# Altium schematic sheet top.SchDoc
size A3; DocumentNumber: 1; SheetNumber: 1; SheetTotal: 6
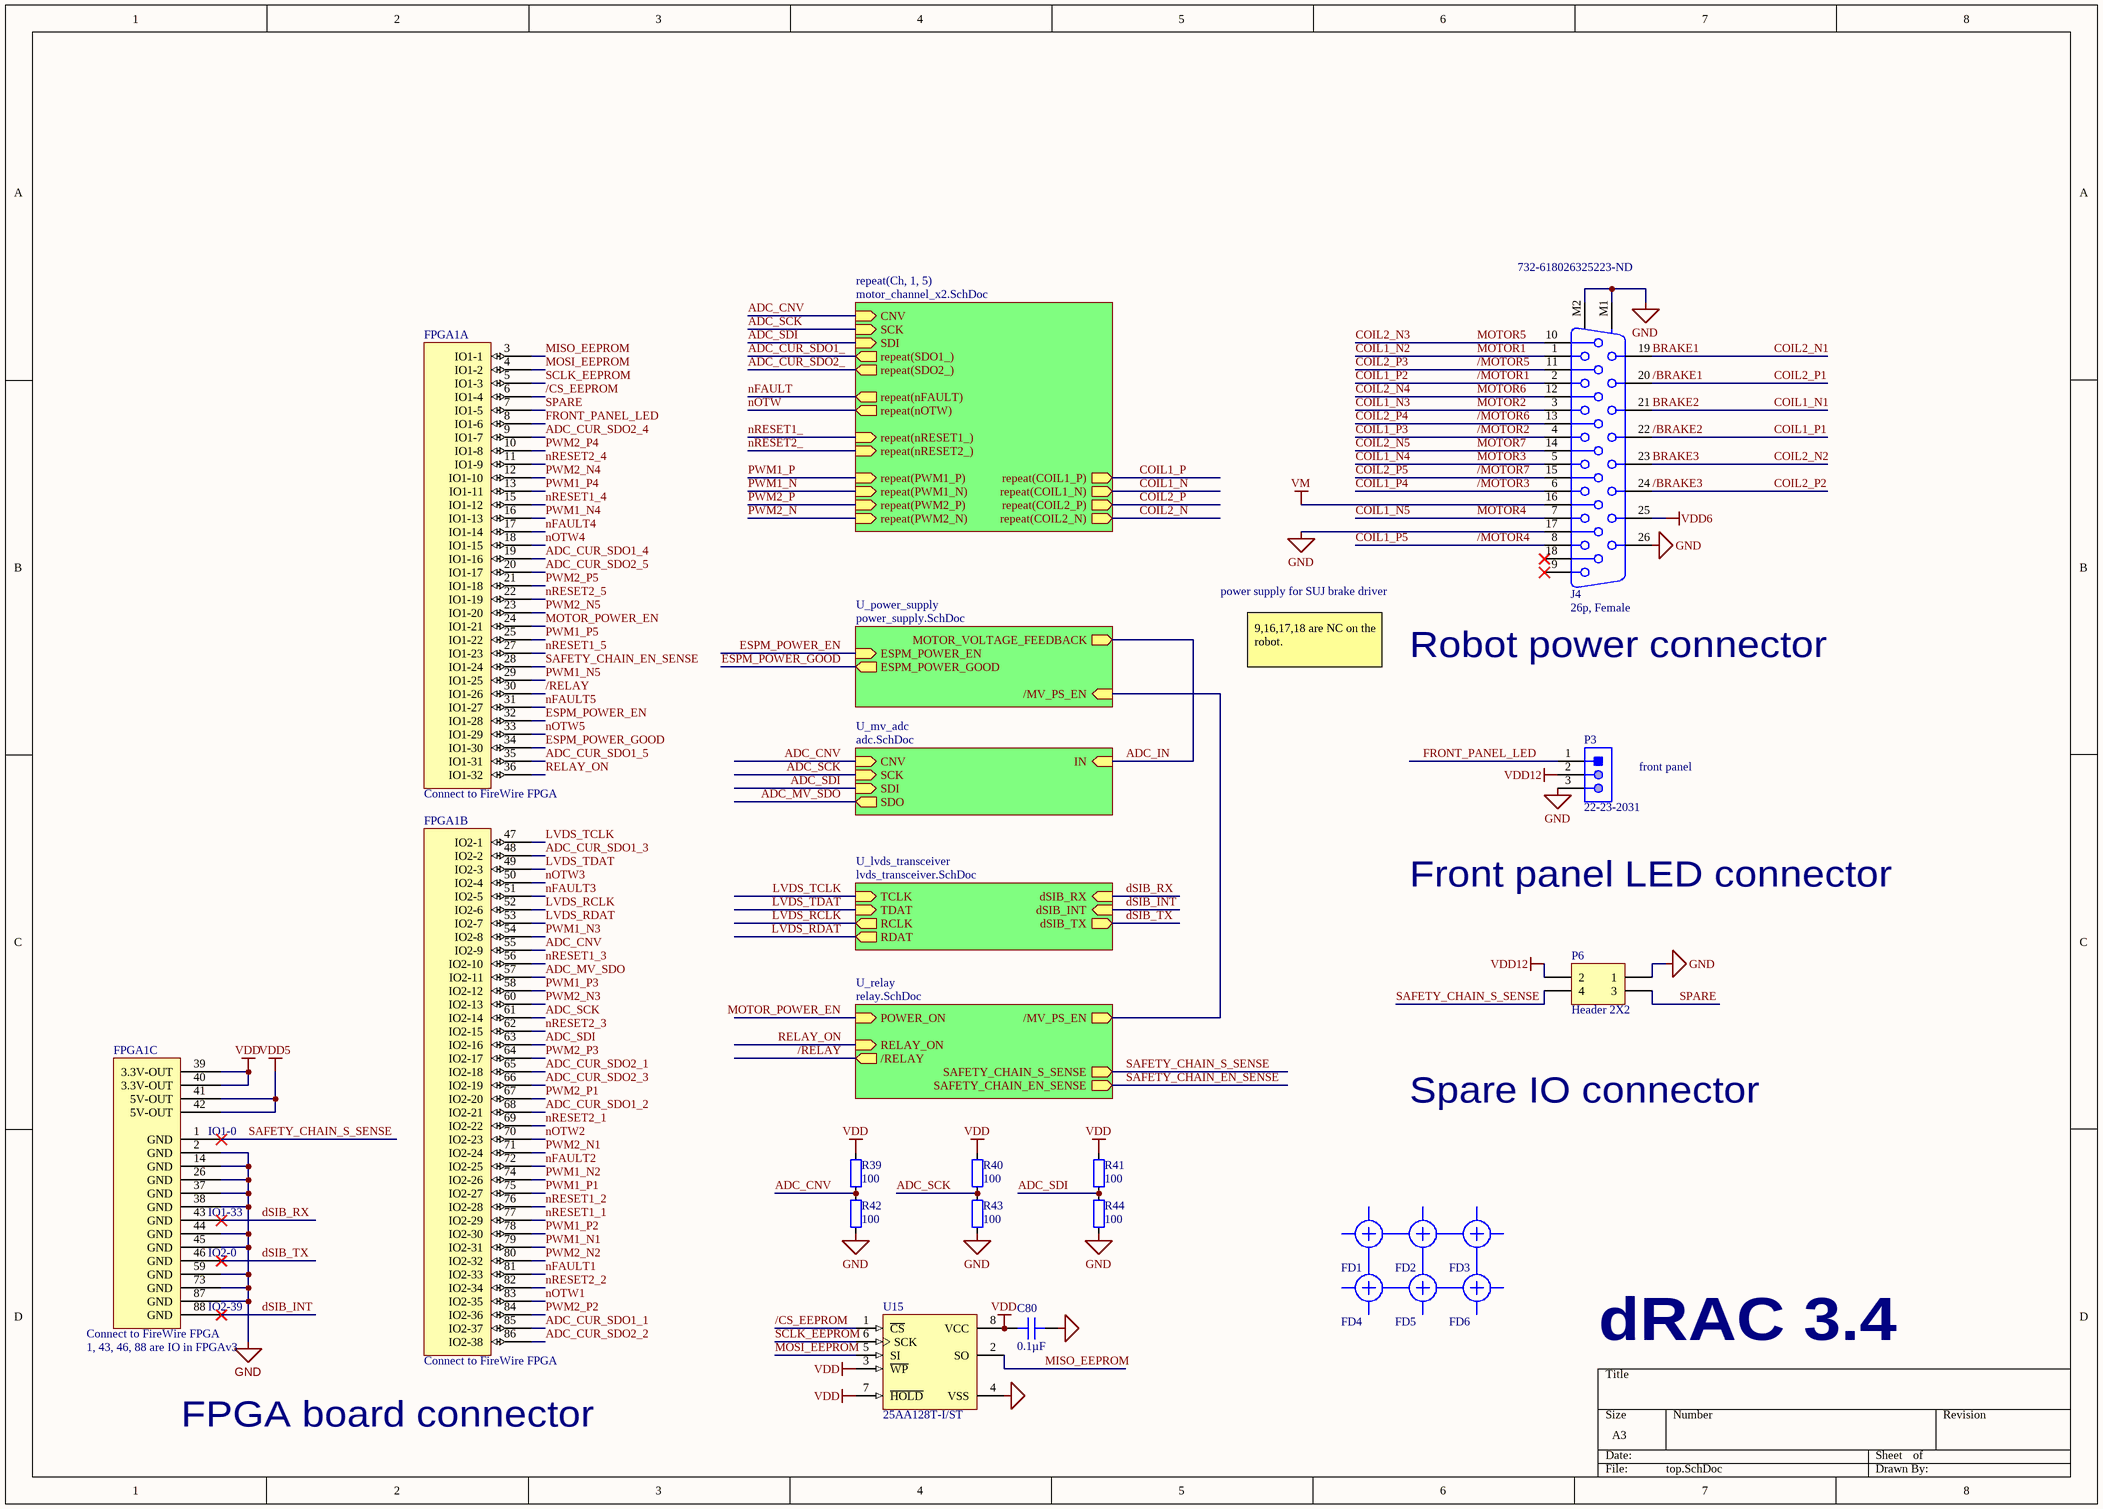
[diagram p0: top.SchDoc]

## Parts
C80  0.1µF  [FP-GRM155-0_05-IPC_B]
FD1  FD  [FD]  (value not drawn)  (no BOM)
FD2  FD  [FD]  (value not drawn)  (no BOM)
FD3  FD  [FD]  (value not drawn)  (no BOM)
FD4  FD  [FD]  (value not drawn)  (no BOM)
FD5  FD  [FD]  (value not drawn)  (no BOM)
FD6  FD  [FD]  (value not drawn)  (no BOM)
FPGA1  Connect to FireWire FPGA  [FPGA-dummy]  (parts A,B,C of 3)
J4  26p, Female  Supplier Part Number 1: 732-618026325223-ND  [618026325223]
P3  22-23-2031  [MOLX-22-23-2031_V]
P6  Header 2X2  [DF11-4DP-2DSA]
R39  value 100  [FP-CRCW0805-HPe3-IPC_B]  (hidden comment: Res_0805)
R40  value 100  [FP-CRCW0805-HPe3-IPC_B]  (hidden comment: Res_0805)
R41  value 100  [FP-CRCW0805-HPe3-IPC_B]  (hidden comment: Res_0805)
R42  value 100  [FP-CRCW0805-HPe3-IPC_B]  (hidden comment: Res_0805)
R43  value 100  [FP-CRCW0805-HPe3-IPC_B]  (hidden comment: Res_0805)
R44  value 100  [FP-CRCW0805-HPe3-IPC_B]  (hidden comment: Res_0805)
U15  25AA128T-I/ST  [TSSOP-ST8_N]

## Sub-sheets
repeat(Ch, 1, 5) = motor_channel_x2.SchDoc: repeat(COIL1_P) (out), repeat(COIL1_N) (out), repeat(COIL2_P) (out), repeat(COIL2_N) (out), repeat(SDO1_) (out), repeat(SDO2_) (out), CNV (in), SCK (in), SDI (in), repeat(nRESET1_) (in), repeat(nRESET2_) (in), repeat(PWM1_P) (in), repeat(PWM1_N) (in), repeat(PWM2_P) (in), repeat(PWM2_N) (in), repeat(nFAULT) (out), repeat(nOTW) (out)
U_lvds_transceiver = lvds_transceiver.SchDoc: RCLK (out), RDAT (out), TCLK (in), TDAT (in), dSIB_RX (in), dSIB_INT (in), dSIB_TX (out)
U_mv_adc = adc.SchDoc: CNV (in), SCK (in), SDI (in), SDO (out), IN (in)
U_power_supply = power_supply.SchDoc: MOTOR_VOLTAGE_FEEDBACK (out), ESPM_POWER_GOOD (out), ESPM_POWER_EN (in), /MV_PS_EN (in)
U_relay = relay.SchDoc: POWER_ON (in), RELAY_ON (in), /RELAY (out), /MV_PS_EN (out), SAFETY_CHAIN_S_SENSE (out), SAFETY_CHAIN_EN_SENSE (out)

## Nets
GND: C80.2 FPGA1.2(GND) FPGA1.14(GND) FPGA1.26(GND) FPGA1.37(GND) FPGA1.38(GND) FPGA1.44(GND) FPGA1.45(GND) FPGA1.59(GND) FPGA1.73(GND) FPGA1.87(GND) J4.17 J4.26 J4.M1 J4.M2 P3.3 P6.1 R42.1 R43.1 R44.1 U15.4(VSS)
VDD: C80.1 FPGA1.39(3.3V-OUT) FPGA1.40(3.3V-OUT) R39.2 R40.2 R41.2 U15.3(~{WP}) U15.7(~{HOLD}) U15.8(VCC)
VDD5: FPGA1.41(5V-OUT) FPGA1.42(5V-OUT)
VDD6: J4.25
VDD12: P3.2 P6.2
VM: J4.16
/BRAKE1: J4.20  [also labelled COIL2_P1]
/BRAKE2: J4.22  [also labelled COIL1_P1]
/BRAKE3: J4.24  [also labelled COIL2_P2]
/CS_EEPROM: FPGA1.6(IO1-4) U15.1(~{CS})
/MOTOR1: J4.2  [also labelled COIL1_P2]
/MOTOR2: J4.4  [also labelled COIL1_P3]
/MOTOR3: J4.6  [also labelled COIL1_P4]
/MOTOR4: J4.8  [also labelled COIL1_P5]
/MOTOR5: J4.11  [also labelled COIL2_P3]
/MOTOR6: J4.13  [also labelled COIL2_P4]
/MOTOR7: J4.15  [also labelled COIL2_P5]
/RELAY: FPGA1.30(IO1-26) ; sheet U_relay//RELAY
ADC_CNV: FPGA1.55(IO2-9) R39.1 R42.2 ; sheet U_mv_adc/CNV, sheet repeat(Ch, 1, 5)/CNV
ADC_CUR_SDO1_: sheet repeat(Ch, 1, 5)/repeat(SDO1_)
ADC_CUR_SDO1_1: FPGA1.85(IO2-37)
ADC_CUR_SDO1_2: FPGA1.68(IO2-21)
ADC_CUR_SDO1_3: FPGA1.48(IO2-2)
ADC_CUR_SDO1_4: FPGA1.19(IO1-16)
ADC_CUR_SDO1_5: FPGA1.35(IO1-31)
ADC_CUR_SDO2_: sheet repeat(Ch, 1, 5)/repeat(SDO2_)
ADC_CUR_SDO2_1: FPGA1.65(IO2-18)
ADC_CUR_SDO2_2: FPGA1.86(IO2-38)
ADC_CUR_SDO2_3: FPGA1.66(IO2-19)
ADC_CUR_SDO2_4: FPGA1.9(IO1-7)
ADC_CUR_SDO2_5: FPGA1.20(IO1-17)
ADC_IN: sheet U_mv_adc/IN, sheet U_power_supply/MOTOR_VOLTAGE_FEEDBACK
ADC_MV_SDO: FPGA1.57(IO2-11) ; sheet U_mv_adc/SDO
ADC_SCK: FPGA1.61(IO2-14) R40.1 R43.2 ; sheet U_mv_adc/SCK, sheet repeat(Ch, 1, 5)/SCK
ADC_SDI: FPGA1.63(IO2-16) R41.1 R44.2 ; sheet U_mv_adc/SDI, sheet repeat(Ch, 1, 5)/SDI
BRAKE1: J4.19  [also labelled COIL2_N1]
BRAKE2: J4.21  [also labelled COIL1_N1]
BRAKE3: J4.23  [also labelled COIL2_N2]
COIL1_N: sheet repeat(Ch, 1, 5)/repeat(COIL1_N)
COIL1_N2: J4.1  [also labelled MOTOR1]
COIL1_N3: J4.3  [also labelled MOTOR2]
COIL1_N4: J4.5  [also labelled MOTOR3]
COIL1_N5: J4.7  [also labelled MOTOR4]
COIL1_P: sheet repeat(Ch, 1, 5)/repeat(COIL1_P)
COIL2_N: sheet repeat(Ch, 1, 5)/repeat(COIL2_N)
COIL2_N3: J4.10  [also labelled MOTOR5]
COIL2_N4: J4.12  [also labelled MOTOR6]
COIL2_N5: J4.14  [also labelled MOTOR7]
COIL2_P: sheet repeat(Ch, 1, 5)/repeat(COIL2_P)
dSIB_INT: FPGA1.88(GND) ; sheet U_lvds_transceiver/dSIB_INT
dSIB_RX: FPGA1.43(GND) ; sheet U_lvds_transceiver/dSIB_RX
dSIB_TX: FPGA1.46(GND) ; sheet U_lvds_transceiver/dSIB_TX
ESPM_POWER_EN: FPGA1.32(IO1-28) ; sheet U_power_supply/ESPM_POWER_EN
ESPM_POWER_GOOD: FPGA1.34(IO1-30) ; sheet U_power_supply/ESPM_POWER_GOOD
FRONT_PANEL_LED: FPGA1.8(IO1-6) P3.1
LVDS_RCLK: FPGA1.52(IO2-6) ; sheet U_lvds_transceiver/RCLK
LVDS_RDAT: FPGA1.53(IO2-7) ; sheet U_lvds_transceiver/RDAT
LVDS_TCLK: FPGA1.47(IO2-1) ; sheet U_lvds_transceiver/TCLK
LVDS_TDAT: FPGA1.49(IO2-3) ; sheet U_lvds_transceiver/TDAT
MISO_EEPROM: FPGA1.3(IO1-1) U15.2(SO)
MOSI_EEPROM: FPGA1.4(IO1-2) U15.5(SI)
MOTOR_POWER_EN: FPGA1.24(IO1-21) ; sheet U_relay/POWER_ON
nFAULT: sheet repeat(Ch, 1, 5)/repeat(nFAULT)
nFAULT1: FPGA1.81(IO2-33)
nFAULT2: FPGA1.72(IO2-25)
nFAULT3: FPGA1.51(IO2-5)
nFAULT4: FPGA1.17(IO1-14)
nFAULT5: FPGA1.31(IO1-27)
nOTW: sheet repeat(Ch, 1, 5)/repeat(nOTW)
nOTW1: FPGA1.83(IO2-35)
nOTW2: FPGA1.70(IO2-23)
nOTW3: FPGA1.50(IO2-4)
nOTW4: FPGA1.18(IO1-15)
nOTW5: FPGA1.33(IO1-29)
nRESET1_: sheet repeat(Ch, 1, 5)/repeat(nRESET1_)
nRESET1_1: FPGA1.77(IO2-29)
nRESET1_2: FPGA1.76(IO2-28)
nRESET1_3: FPGA1.56(IO2-10)
nRESET1_4: FPGA1.15(IO1-12)
nRESET1_5: FPGA1.27(IO1-23)
nRESET2_: sheet repeat(Ch, 1, 5)/repeat(nRESET2_)
nRESET2_1: FPGA1.69(IO2-22)
nRESET2_2: FPGA1.82(IO2-34)
nRESET2_3: FPGA1.62(IO2-15)
nRESET2_4: FPGA1.11(IO1-9)
nRESET2_5: FPGA1.22(IO1-19)
PWM1_N: sheet repeat(Ch, 1, 5)/repeat(PWM1_N)
PWM1_N1: FPGA1.79(IO2-31)
PWM1_N2: FPGA1.74(IO2-26)
PWM1_N3: FPGA1.54(IO2-8)
PWM1_N4: FPGA1.16(IO1-13)
PWM1_N5: FPGA1.29(IO1-25)
PWM1_P: sheet repeat(Ch, 1, 5)/repeat(PWM1_P)
PWM1_P1: FPGA1.75(IO2-27)
PWM1_P2: FPGA1.78(IO2-30)
PWM1_P3: FPGA1.58(IO2-12)
PWM1_P4: FPGA1.13(IO1-11)
PWM1_P5: FPGA1.25(IO1-22)
PWM2_N: sheet repeat(Ch, 1, 5)/repeat(PWM2_N)
PWM2_N1: FPGA1.71(IO2-24)
PWM2_N2: FPGA1.80(IO2-32)
PWM2_N3: FPGA1.60(IO2-13)
PWM2_N4: FPGA1.12(IO1-10)
PWM2_N5: FPGA1.23(IO1-20)
PWM2_P: sheet repeat(Ch, 1, 5)/repeat(PWM2_P)
PWM2_P1: FPGA1.67(IO2-20)
PWM2_P2: FPGA1.84(IO2-36)
PWM2_P3: FPGA1.64(IO2-17)
PWM2_P4: FPGA1.10(IO1-8)
PWM2_P5: FPGA1.21(IO1-18)
RELAY_ON: FPGA1.36(IO1-32) ; sheet U_relay/RELAY_ON
SAFETY_CHAIN_EN_SENSE: FPGA1.28(IO1-24) ; sheet U_relay/SAFETY_CHAIN_EN_SENSE
SAFETY_CHAIN_S_SENSE: FPGA1.1(GND) P6.4 ; sheet U_relay/SAFETY_CHAIN_S_SENSE
SCLK_EEPROM: FPGA1.5(IO1-3) U15.6(SCK)
SPARE: FPGA1.7(IO1-5) P6.3
(unnamed): sheet U_power_supply//MV_PS_EN, sheet U_relay//MV_PS_EN

Not connected (* = marked no-connect by the designer): J4 9* 18*

## Notes on the sheet
- power supply for SUJ brake driver
- 9,16,17,18 are NC on the robot.
- Robot power connector
- front panel
- Front panel LED connector
- Spare IO connector
- (near FPGA1) IO1-0
- (near FPGA1) IO1-33
- (near FPGA1) IO2-0
- (near FPGA1) IO2-39
- (near FPGA1) 1, 43, 46, 88 are IO in FPGAv3
- dRAC 3.4
- FPGA board connector

## Library data of the parts
C80 = 04023C104KAT2A: CAP CER 0.1UF 25V X7R 0402; Manufacturer: AVX Corporation; Tolerance: ±10%; Value: 0.1µF; Part Number: 04023C104KAT2A; Applications: General Purpose; Capacitance: 0.1µF; ComponentLink1Description: Datasheet; ComponentLink1URL: http://datasheets.avx.com/X7RDielectric.pdf; ComponentLink2Description: DigiKey Link; ComponentLink2URL: http://digikey.com/product-detail/en/avx-corporation/04023C104KAT2A/478-7868-1-ND/3881491; Device Package: 0402 (1005 Metric); LastUpdated: 9/2/2020 1:02:21 AM; Lifecycle Status: Active; Minimum Order: 1; Mounting Type: Surface Mount, MLCC; Operating Temperature: -55°C ~ 125°C; Package / Case: 0402 (1005 Metric); Packaging: CutTape; PartId: 3190; Part Status: Active; Price: 0.13; Series: -; Size / Dimension: 0.039" L x 0.020" W (1.00mm x 0.50mm); Supplier 1: DigiKey; Supplier Part Number 1: 478-7868-1-ND; Temperature Coefficient: X7R; Thickness (Max): 0.022" (0.55mm); Voltage - Rated: 25V
FPGA1 = fpga_dummy: ClassName: noclearancecheck
J4 = 618026325223: WR-DSUB Female High Density Angled PCB Connector without Hex Screw, 26p; Manufacturer: Wurth Electronics; PinNumber: 26; Published: June 2016; Publisher: Wurth Elektronik; ComponentLink1Description: Manufacturer; ComponentLink1URL: http://www.we-online.de; ComponentLink2Description: Datasheet; ComponentLink2URL: http://katalog.we-online.de/em/datasheet/6180xx325223.pdf; PartNumber: 618026325223; system: connector; Supplier 1: Digi-Key; Manufacturer Part Number: 618026325223; RoHS: Yes; Stock 1: 325; Pricing 1: 1=8.10000, 10=7.69500, 50=7.15500, 100=6.75000, 250=6.21000, 500=5.40002 (USD); RoHS Compliant: Yes
P3 = CMP-2000-05242-1: Male Header, Pitch 2.54 mm, 1 x 3 Position, Height 8.18 mm, Tail Length 3.56 mm, RoHS, Bulk; Current Rating: 4A; Brand: Molex; Pitch: 2.54mm; Voltage Rating: 250V; Mounting Angle: Vertical; Type: Locking; Factory Pack Quantity: 16000; Tradename: KK; Housing Material: Nylon; Contact Material: Brass; Manufacturer URL: http://www.molex.com/; Termination Style: ThroughHole; Mounting Style: ThroughHole; Number of Positions: 3Position; Contact Gender: Pin(Male); Packaging: Bulk; Series: 6373; Datasheet Version: Sep-01; Contact Plating: Tin; Product: Headers; Datasheet URL: https://datasheet.ciiva.com/19472/232274-19472863.pdf; RoHS: Details; Product Category: Headers&WireHousings; Manufacturer: Molex; Number of Rows: 1Row
P6 = Header 2X2: Header, 2-Pin, Dual row; LatestRevisionDate: 17-Jul-2002; LatestRevisionNote: Re-released for DXP Platform.; Publisher: Altium Limited
R39-R44 = Res_0805: Resistor
U15 = CMP-0165-00422-1: 128K SPI Bus Serial EEPROM, 8-Pin TSSOP, Industrial Temperature, Tape and Reel; PackageVersion: revBB, Aug-2009; PackageDescription: 8-Lead Plastic Thin Shrink Small Outline (ST) - 4.4mm Body [TSSOP]; Code_JEDEC: MO-153; DatasheetVersion: revD, Jun-2009; PackageReference: TSSOP-ST8